# Altium schematic sheet DigiConn.SchDoc
size A4; SheetNumber: 11; SheetTotal: 11
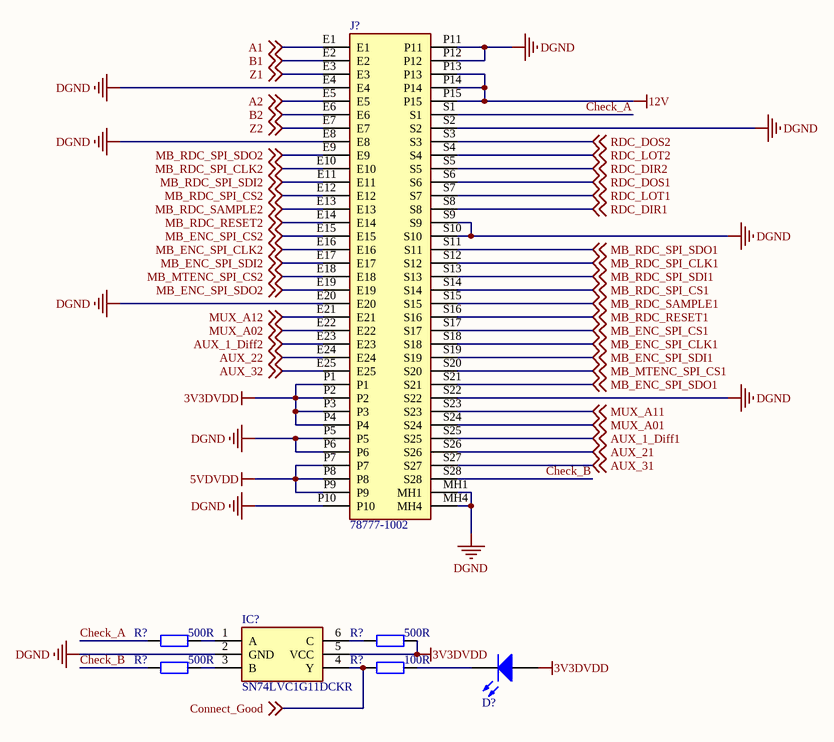
[diagram p0: DigiConn.SchDoc]

## Parts
(Parts that share a designator on the sheet are numbered #1, #2 ... from top to bottom, then left to right.)
D?  LED  [LED_A2]  (value not drawn)
IC?  SN74LVC1G11DCKR  [SOT65P210X110-6N]
J?  78777-1002  [787771002]
R?#1  500R  [R 0603_L]
R?#2  500R  [R 0603_L]
R?#3  500R  [R 0603_L]
R?#4  100R  [R 0603_L]

## Nets
3V3DVDD: D?.1(A) IC?.5(VCC) J?.P1 J?.P2 J?.P3 J?.P4 R?#2.1
5VDVDD: J?.P7 J?.P8 J?.P9
12V: J?.P13 J?.P14 J?.P15
DGND: IC?.2(GND) J?.E4 J?.E8 J?.E20 J?.MH1 J?.MH4 J?.P5 J?.P6 J?.P10 J?.P11 J?.P12 J?.S2 J?.S9 J?.S10 J?.S22
A1: J?.E1 ; off-sheet A1
A2: J?.E5 ; off-sheet A2
AUX_1_Diff1: J?.S25 ; off-sheet AUX_1_Diff1
AUX_1_Diff2: J?.E23 ; off-sheet AUX_1_Diff2
AUX_21: J?.S26 ; off-sheet AUX_21
AUX_22: J?.E24 ; off-sheet AUX_22
AUX_31: J?.S27 ; off-sheet AUX_31
AUX_32: J?.E25 ; off-sheet AUX_32
B1: J?.E2 ; off-sheet B1
B2: J?.E6 ; off-sheet B2
Check_A: J?.S1 R?#1.2
Check_B: J?.S28 R?#3.2
Connect_Good: IC?.4(Y) R?#4.2 ; off-sheet Connect_Good
MB_ENC_SPI_CLK1: J?.S18 ; off-sheet MB_ENC_SPI_CLK1
MB_ENC_SPI_CLK2: J?.E16 ; off-sheet MB_ENC_SPI_CLK2
MB_ENC_SPI_CS1: J?.S17 ; off-sheet MB_ENC_SPI_CS1
MB_ENC_SPI_CS2: J?.E15 ; off-sheet MB_ENC_SPI_CS2
MB_ENC_SPI_SDI1: J?.S19 ; off-sheet MB_ENC_SPI_SDI1
MB_ENC_SPI_SDI2: J?.E17 ; off-sheet MB_ENC_SPI_SDI2
MB_ENC_SPI_SDO1: J?.S21 ; off-sheet MB_ENC_SPI_SDO1
MB_ENC_SPI_SDO2: J?.E19 ; off-sheet MB_ENC_SPI_SDO2
MB_MTENC_SPI_CS1: J?.S20 ; off-sheet MB_MTENC_SPI_CS1
MB_MTENC_SPI_CS2: J?.E18 ; off-sheet MB_MTENC_SPI_CS2
MB_RDC_RESET1: J?.S16 ; off-sheet MB_RDC_RESET1
MB_RDC_RESET2: J?.E14 ; off-sheet MB_RDC_RESET2
MB_RDC_SAMPLE1: J?.S15 ; off-sheet MB_RDC_SAMPLE1
MB_RDC_SAMPLE2: J?.E13 ; off-sheet MB_RDC_SAMPLE2
MB_RDC_SPI_CLK1: J?.S12 ; off-sheet MB_RDC_SPI_CLK1
MB_RDC_SPI_CLK2: J?.E10 ; off-sheet MB_RDC_SPI_CLK2
MB_RDC_SPI_CS1: J?.S14 ; off-sheet MB_RDC_SPI_CS1
MB_RDC_SPI_CS2: J?.E12 ; off-sheet MB_RDC_SPI_CS2
MB_RDC_SPI_SDI1: J?.S13 ; off-sheet MB_RDC_SPI_SDI1
MB_RDC_SPI_SDI2: J?.E11 ; off-sheet MB_RDC_SPI_SDI2
MB_RDC_SPI_SDO1: J?.S11 ; off-sheet MB_RDC_SPI_SDO1
MB_RDC_SPI_SDO2: J?.E9 ; off-sheet MB_RDC_SPI_SDO2
MUX_A01: J?.S24 ; off-sheet MUX_A01
MUX_A02: J?.E22 ; off-sheet MUX_A02
MUX_A11: J?.S23 ; off-sheet MUX_A11
MUX_A12: J?.E21 ; off-sheet MUX_A12
RDC_DIR1: J?.S8 ; off-sheet RDC_DIR1
RDC_DIR2: J?.S5 ; off-sheet RDC_DIR2
RDC_DOS1: J?.S6 ; off-sheet RDC_DOS1
RDC_DOS2: J?.S3 ; off-sheet RDC_DOS2
RDC_LOT1: J?.S7 ; off-sheet RDC_LOT1
RDC_LOT2: J?.S4 ; off-sheet RDC_LOT2
Z1: J?.E3 ; off-sheet Z1
Z2: J?.E7 ; off-sheet Z2
NetD?_2: D?.2(K) R?#4.1
NetIC?_1: IC?.1(A) R?#1.1
NetIC?_3: IC?.3(B) R?#3.1
NetIC?_6: IC?.6(C) R?#2.2

## Library data of the parts
D? = LED: 发光二极管; 技术支持，联系售后: https://shop463601444.taobao.com
IC? = SN74LVC1G11DCKR: Integrated Circuit; Manufacturer_Name: Texas Instruments; Datasheet Link: http://componentsearchengine.com/Datasheets/1/SN74LVC1G11DCKR.pdf; Height: 1.1mm; Manufacturer_Part_Number: SN74LVC1G11DCKR; Mouser Part Number: 595-SN74LVC1G11DCKR; Mouser Price/Stock: https://www.mouser.co.uk/ProductDetail/Texas-Instruments/SN74LVC1G11DCKR?qs=nqigI8dpoHIKzrNU0QT3Ag%3D%3D; Arrow Part Number: SN74LVC1G11DCKR; Arrow Price/Stock: https://www.arrow.com/en/products/sn74lvc1g11dckr/texas-instruments?region=nac
J? = 78777-1002: Connector; Manufacturer_Name: Molex; Datasheet Link: https://www.molex.com/pdm_docs/sd/787771002_sd.pdf; Height: 10.03mm; Manufacturer_Part_Number: 78777-1002; Mouser Part Number: 538-78777-1002; Mouser Price/Stock: https://www.mouser.co.uk/ProductDetail/Molex/78777-1002?qs=PQDAUpz3sUPC2Og%2FkFefJw%3D%3D
R?#1-R?#4 = R: 贴片电阻; 版权归属: 来自淘宝 ID：黄晶宝石; 封装库来自淘宝卖家 ID：黄晶宝石: 其他店铺购入均为盗版，不享受售后技术支持服务，请立即申请退款; BOM名称: 贴片电阻; 联系售后: https://shop463601444.taobao.com